# Altium project WebCamLight_RevB.PrjPcb
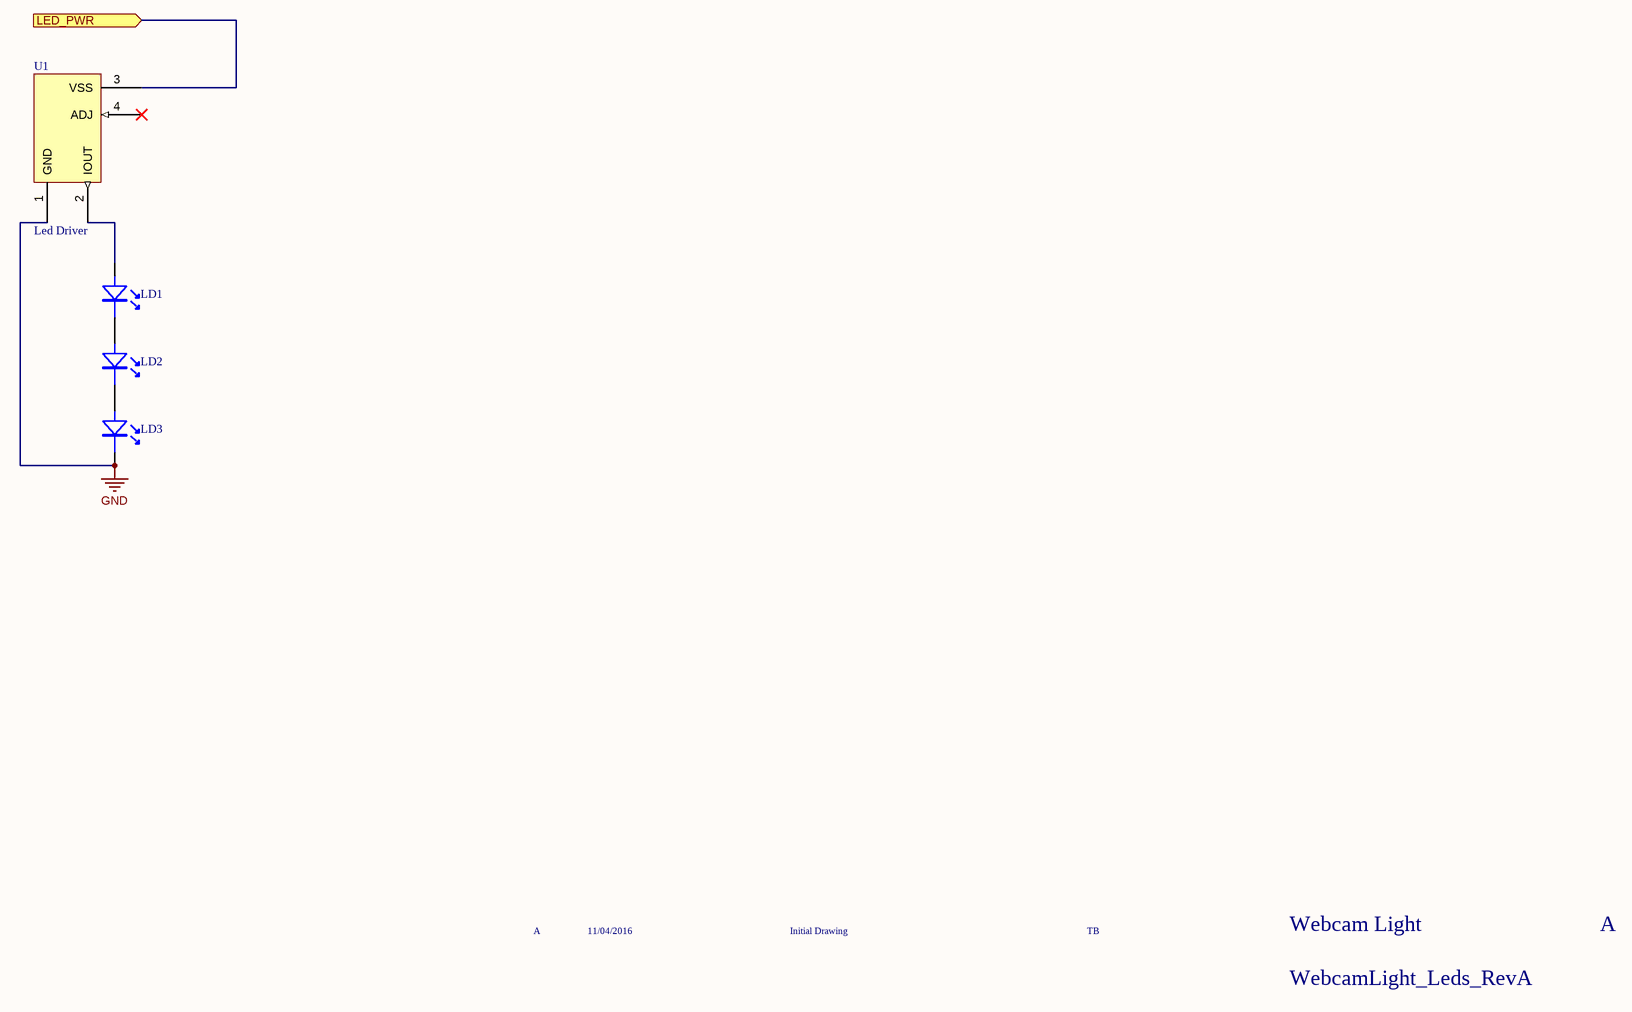
[diagram p0: WebCamLight_Leds_RevB.SchDoc]
1 sheet, 4 parts. Net scope: flat (ports and power ports of the same name join across sheets).
Board file: WebCamLight_RevB.PcbDoc

## Sheet WebCamLight_Leds_RevB.SchDoc
size A3; _PRJ_TITLE: PROJECT TITLE; _SHT_TITLE: Sheet; _REV: A; PageSetup: Record=PageOptions|CenterHorizontal=True|CenterVertical=True|PrintScale=0.71|XCorrection=1.00|YCorrection=1.00|PrintKind=0|BorderSize=5000000|LeftOffset=0|BottomOffset=0|Orientation=2|PaperLength=1000|PaperWidth=1000|Scale=100|PaperSource=258|PrintQuality=600|MediaType=1|DitherType=10|PaperKind=A3 (297x420mm)|PrintScaleMode=1

### Parts
LD1  Green LED 0805  [Wurth_1206_Led]  (value not drawn)
LD2  Green LED 0805  [Wurth_1206_Led]  (value not drawn)
LD3  Green LED 0805  [Wurth_1206_Led]  (value not drawn)
U1  Led Driver  [SOT192P237X110-4M]

### Ports
LED_PWR (in)

### Nets
GND: LD3.1 U1.1(GND)
NetLD1_1: LD1.1 LD2.2
NetLD1_2: LD1.2 U1.2(IOUT)
NetLD2_1: LD2.1 LD3.2
NetU1_3: U1.3(VSS) ; port LED_PWR

Not connected (* = marked no-connect by the designer): U1 4(ADJ)*

### Notes on the sheet
- A
- 11/04/2016
- Initial Drawing
- TB
- Webcam Light
- WebcamLight_Leds_RevA
- TEMPLATE MODIFIED 09/04/16
- PCBA REV
- DATE
- ECO
- DESCRIPTION
- DRAWN
- APPROVED
- FILE NAME
- PCB REVISION
- Sheet NAME
- SCALE
- SHEET
- NTS
- SHEET SIZE
- A3

### Library data of the parts
LD1-LD3 = LED_White_1206: WL-SMCW SMD CHIP LED WATERCLEAR; Manufacturer: Wurth; Manufacturer P/N: 158301260
U1 = IC_LED_DRV_BCR401R: 20-60mA Led Driver; Manufacturer: Infineon; Manufacturer P/N: BCR401R